# Altium schematic sheet main.SchDoc
size A3; SheetNumber: 1; SheetTotal: 1
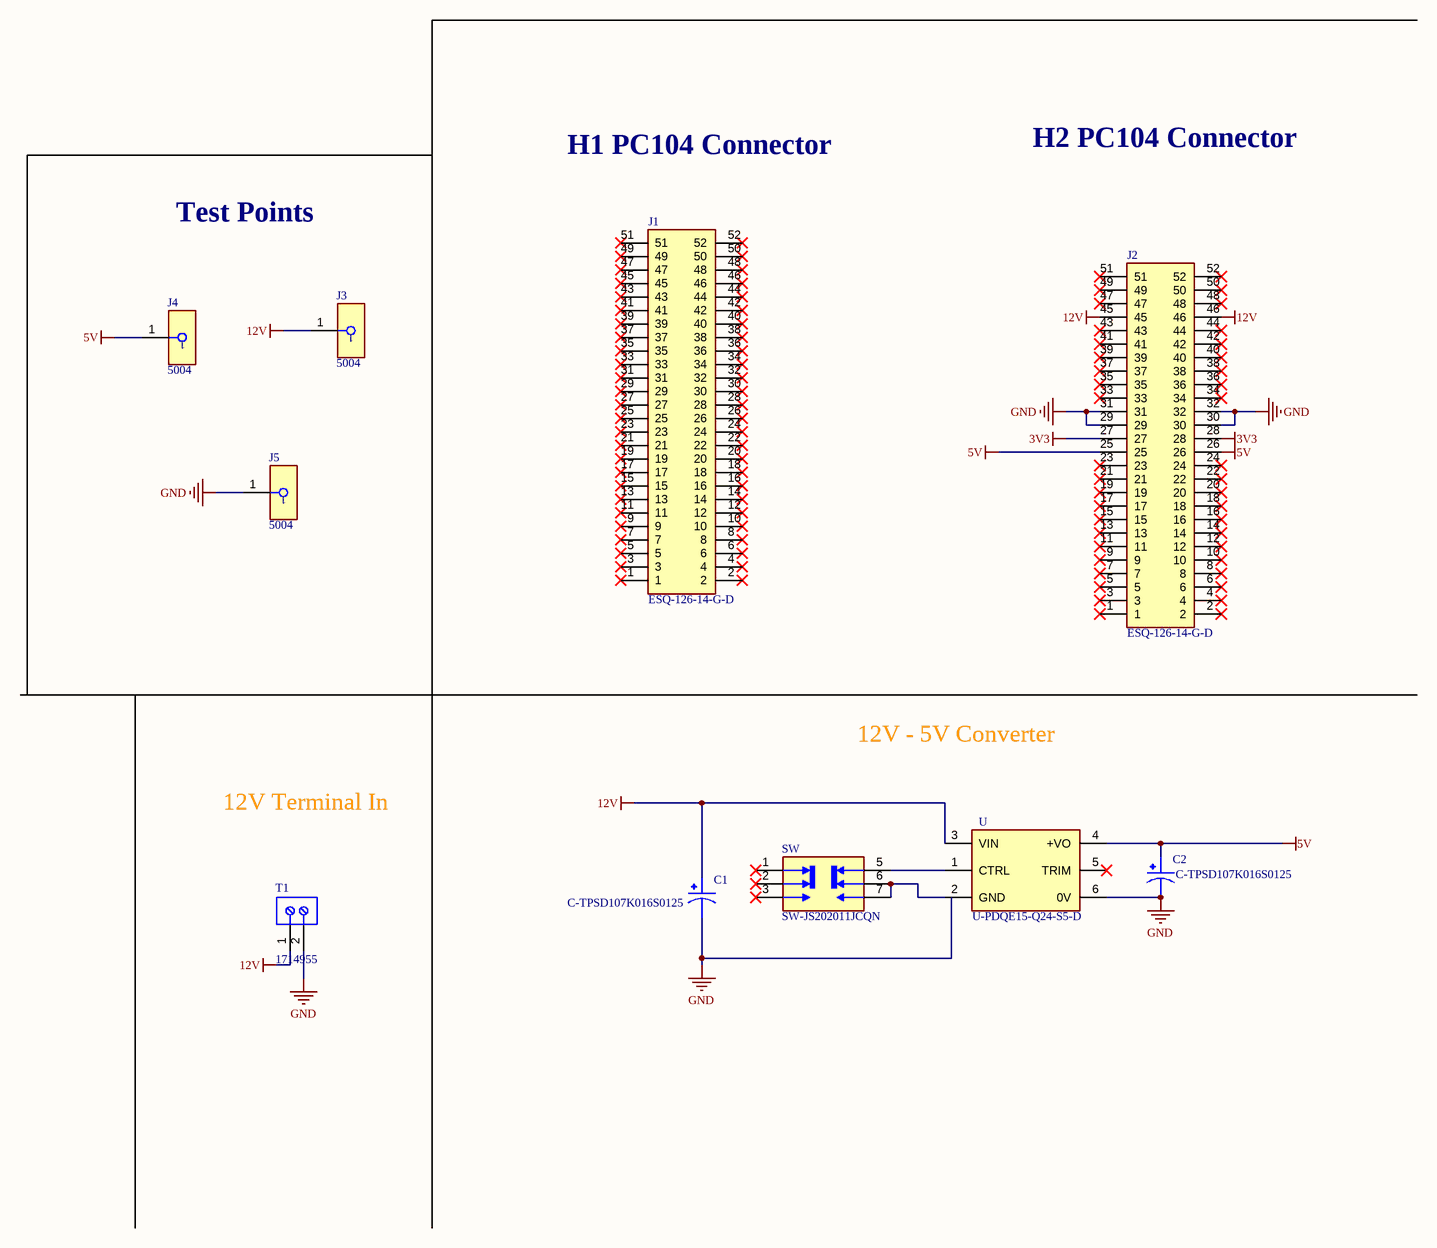
[diagram p0: main.SchDoc]

## Parts
C1  C-TPSD107K016S0125  [C-TPSD107K016S0125]
C2  C-TPSD107K016S0125  [C-TPSD107K016S0125]
J1  ESQ-126-14-G-D  [SAMTEC_ESQ-126-14-G-D]
J2  ESQ-126-14-G-D  [SAMTEC_ESQ-126-14-G-D]
J3  5004  [FP-5004-MFG]
J4  5004  [FP-5004-MFG]
J5  5004  [FP-5004-MFG]
SW  SW-JS202011JCQN  [SW-JS202011JCQN]
T1  1714955  [PHOE-1714955_V]
U  U-PDQE15-Q24-S5-D  [U-PDQE15-Q48-D5-D]

## Nets
3V3: J2.27 J2.28
5V: C2.1 J2.25 J2.26 J4.1 U.4(+VO)
12V: C1.1 J2.45 J2.46 J3.1 T1.1 U.3(VIN)
GND: C1.2 C2.2 J2.29 J2.30 J2.31 J2.32 J5.1 T1.2 U.6(0V)
NetSW_5: SW.5 U.1(CTRL)
NetSW_6: SW.6 SW.7 U.2(GND)

Not connected (* = marked no-connect by the designer): J1 1* 2* 3* 4* 5* 6* 7* 8* 9* 10* 11* 12* 13* 14* 15* 16* 17* 18* 19* 20* 21* 22* 23* 24* 25* 26* 27* 28* 29* 30* 31* 32* 33* 34* 35* 36* 37* 38* 39* 40* 41* 42* 43* 44* 45* 46* 47* 48* 49* 50* 51* 52*; J2 1* 2* 3* 4* 5* 6* 7* 8* 9* 10* 11* 12* 13* 14* 15* 16* 17* 18* 19* 20* 21* 22* 23* 24* 33* 34* 35* 36* 37* 38* 39* 40* 41* 42* 43* 44* 47* 48* 49* 50* 51* 52*; SW 1* 2* 3*; U 5(TRIM)*

## Notes on the sheet
- H1 PC104 Connector
- H2 PC104 Connector
- Test Points
- 12V - 5V Converter
- 12V Terminal In
- THIS DOCUMENT AND THE DATA DISCLOSED HEREIN OR
- HEREWITH IS THE PROPERTY OF ALTIUM LIMITED AND MAY
- DWG NO:
- REVISION
- REV:
- DESCRIPTION
- DATE
- APPROVED
- BE FREELY DISTRIBUTED IN WHOLE. NO RIGHTS ARE
- RESERVED OR EXPRESS OR IMPLIED WARANTEE GIVEN.
- ENG:
- APPROVALS
- PROJECT
- DSN:
- CHK:
- REFERENCE DOCUMENTS
- PROJECT REVISION:
- TITLE
- DOCUMENT REVISION:
- DESIGN ITEM:
- BOM:
- FAB DWG:
- PCB DWG:
- ASSY DWG:
- SCALE:
- A3
- SIZE
- CAGE CODE
- FILE NAME
- DWG NO.
- SHEET
- OF
- REV

## Library data of the parts
C1 C2 = C-TPSD107K016S0125: CAP TANT 100UF 10% 16V 2917; Manufacturer: KYOCERA AVX; Distributor: Digikey; Digi-Key Part #: 478-9141-1-ND; Manufacturer Part #: TPSD107K016S0125
J1 J2 = J-ESQ-126-14-G-D: CONN SOCKET 52POS 0.1 GOLD PCB; Manufacturer: Samtec Inc.; Manufacturer Part #: ESQ-126-14-G-D; Distributor: Digikey; Distributor Part #: SAM11114-ND
J3-J5 = CMP-2000-05575-2: PC TEST POINT MINIATURE YELLOW; Manufacturer: Keystone Electronics; Number Of Contacts: 1; Is Female: yes; Device Class L1: Connectors; Manufacturer Part Number: 5004; Digikey Description: PC TEST POINT MINIATURE YELLOW; ComponentLink2URL: https://www.keyelco.com/product-pdf.cfm?p=1313; Lead Free: Yes; ComponentLink2Description: Datasheet; Category: Conn; Height: 4.72mm; Octopart: https://octopart.com/5004-keystone-28591; Mouser Description: TEST POINT PC MINI .040"D YELLOW; Device Class L3: unset; Contact Material: Silver; Package: 5004; Automotive: No; Device Class L2: unset; RoHS: TRUE
SW = SW-JS202011JCQN: SWITCH SLIDE DPDT 300MA 6V; Manufacturer: C&K; Distributor: Digi-key; Distributor Part #: CKN10723CT-ND; Manufacturer Part #: JS202011JCQN
T1 = CMP-2000-05797-1: PC Terminal Block, Pitch 6.35 mm, 1 x 2 Position, Height 21.5 mm, Tail Lenght 5.1 mm, RoHS, Bulk; Manufacturer: Phoenix Contact; Package Description: PC Terminal Block, Pitch 6.35 mm, 1 x 2 Position, Height 21.5 mm, Tail Lenght 5.1 mm; Datasheet URL: http://media.digikey.com/pdf/Data%20Sheets/Phoenix%20Contact%20PDFs/1714955.pdf; Package Reference: 1714955; Manufacturer URL: http://www.phoenixcontact.com/; Datasheet Version: 02/2010; Mounting Technology: ThroughHole
U = U-PDQE15-Q24-S5-D: 15 W, 4:1 Input Range, Single/Dual Regulated Output, DIP, 1500 Vdc Isolation, Dc-Dc Converter; Manufactuer: CUI Inc.; Distributor: Digikey; Manufactuer Part #: PDQE15-Q24-S5-D; Distributor Part #: 102-6253-ND